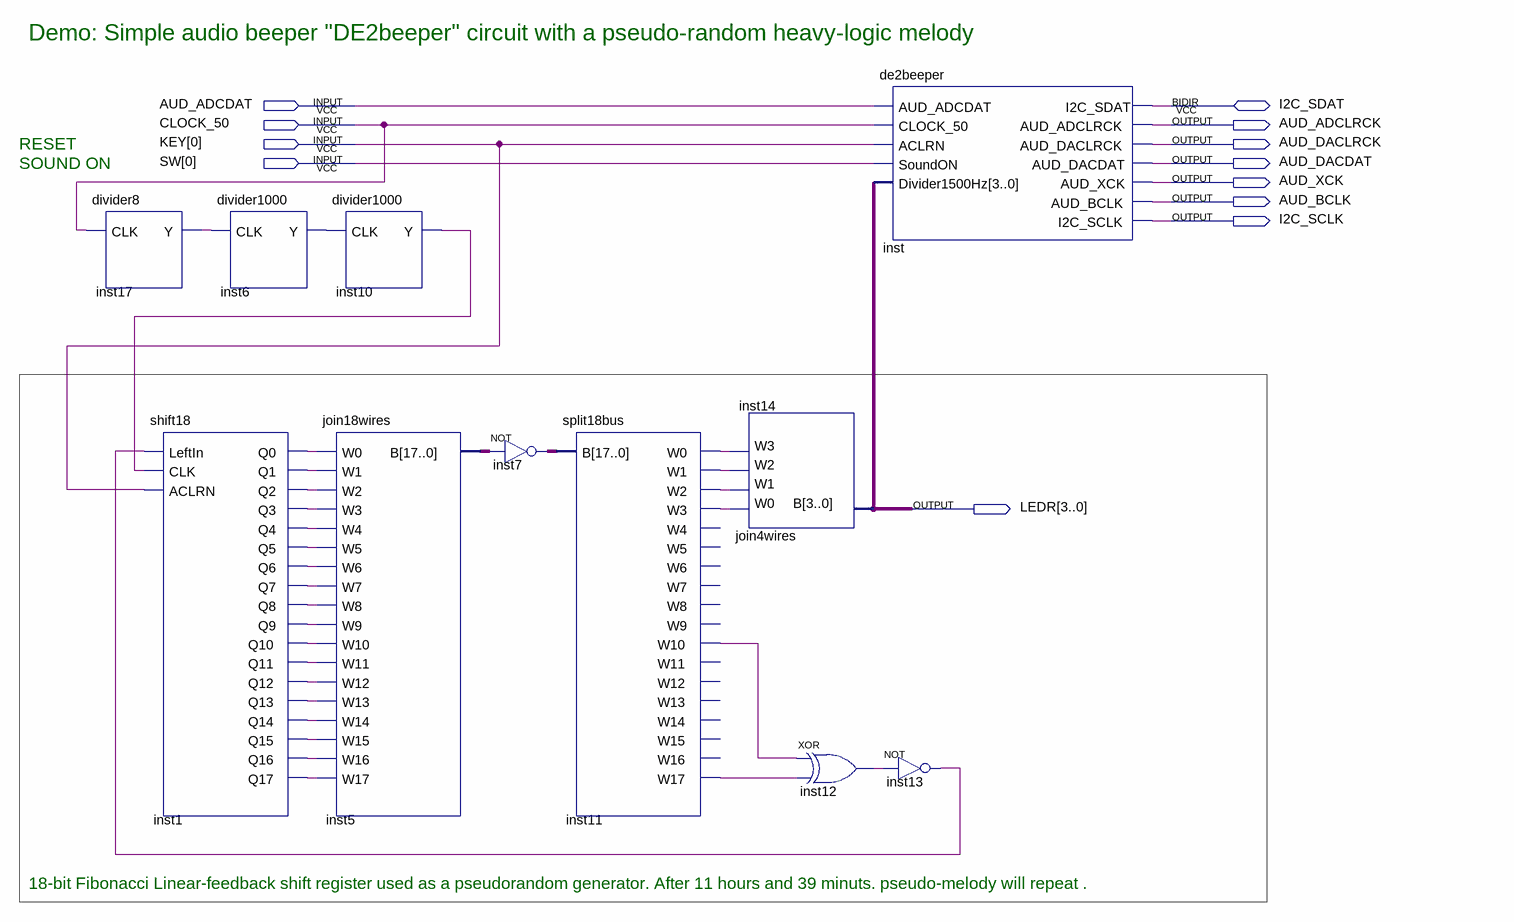
[diagram p0: schematic sheet]
// Quartus schematic test_DE2beepMelody.bdf as structural Verilog: 11 symbols, 12 pins
module test_DE2beepMelody (
  input  AUD_ADCDAT,
  input  CLOCK_50,
  input  [0:0] KEY,
  input  [0:0] SW,
  inout  I2C_SDAT,
  output AUD_ADCLRCK,
  output AUD_DACLRCK,
  output AUD_DACDAT,
  output AUD_XCK,
  output AUD_BCLK,
  output I2C_SCLK,
  output [3:0] LEDR
);

  wire inst1_q0, inst1_q1, inst1_q2, inst1_q3, inst1_q4, inst1_q5, inst1_q6, inst1_q7, inst1_q8, inst1_q9,
       inst1_q10, inst1_q11, inst1_q12, inst1_q13, inst1_q14, inst1_q15, inst1_q16, inst1_q17, inst6_y,
       inst10_y, inst11_w0, inst11_w1, inst11_w2, inst11_w3, inst11_w10, inst11_w17, inst12_out, inst13_out,
       inst17_y;
  wire [17:0] inst5_b, inst7_out;

  divider8 inst17 (.CLK(CLOCK_50), .Y(inst17_y));
  shift18 inst1 (
    .LeftIn(inst13_out), .CLK(inst10_y), .ACLRN(KEY[0]), .Q0(inst1_q0), .Q1(inst1_q1), .Q2(inst1_q2),
    .Q3(inst1_q3), .Q4(inst1_q4), .Q5(inst1_q5), .Q6(inst1_q6), .Q7(inst1_q7), .Q8(inst1_q8), .Q9(inst1_q9),
    .Q10(inst1_q10), .Q11(inst1_q11), .Q12(inst1_q12), .Q13(inst1_q13), .Q14(inst1_q14), .Q15(inst1_q15),
    .Q16(inst1_q16), .Q17(inst1_q17));
  divider1000 inst6 (.CLK(inst17_y), .Y(inst6_y));
  join18wires inst5 (
    .W0(inst1_q0), .W1(inst1_q1), .W2(inst1_q2), .W3(inst1_q3), .W4(inst1_q4), .W5(inst1_q5), .W6(inst1_q6),
    .W7(inst1_q7), .W8(inst1_q8), .W9(inst1_q9), .W10(inst1_q10), .W11(inst1_q11), .W12(inst1_q12),
    .W13(inst1_q13), .W14(inst1_q14), .W15(inst1_q15), .W16(inst1_q16), .W17(inst1_q17), .B(inst5_b));
  divider1000 inst10 (.CLK(inst6_y), .Y(inst10_y));
  assign inst7_out = ~inst5_b;  // NOT inst7, 18 bits wide
  split18bus inst11 (
    .B(inst7_out), .W0(inst11_w0), .W1(inst11_w1), .W2(inst11_w2), .W3(inst11_w3), .W10(inst11_w10),
    .W17(inst11_w17));  // open: W4, W5, W6, W7, W8, W9, W11, W12, W13, W14, W15, W16
  join4wires inst14 (.W0(inst11_w3), .W1(inst11_w2), .W2(inst11_w1), .W3(inst11_w0), .B(LEDR));
  xor inst12 (inst12_out, inst11_w10, inst11_w17);
  de2beeper inst (
    .AUD_ADCDAT(AUD_ADCDAT), .CLOCK_50(CLOCK_50), .ACLRN(KEY[0]), .SoundON(SW[0]), .Divider1500Hz(LEDR),
    .AUD_ADCLRCK(AUD_ADCLRCK), .AUD_DACLRCK(AUD_DACLRCK), .AUD_DACDAT(AUD_DACDAT), .AUD_XCK(AUD_XCK),
    .AUD_BCLK(AUD_BCLK), .I2C_SCLK(I2C_SCLK), .I2C_SDAT(I2C_SDAT));
  not inst13 (inst13_out, inst12_out);

  // Notes on the sheet:
  //   Demo: Simple audio beeper "DE2beeper" circuit with a pseudo-random heavy-logic melody
  //   RESET
  //   SOUND ON
  //   18-bit Fibonacci Linear-feedback shift register used as a pseudorandom generator. After 11 hours and 39 minuts. pseudo-melody will repeat . 
endmodule
